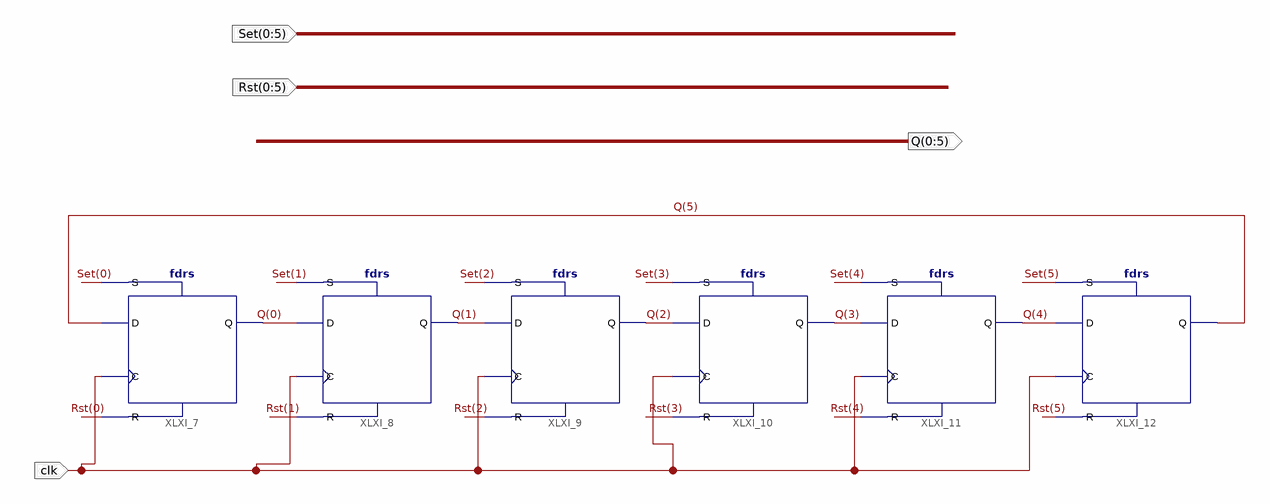
[diagram p0: schematic sheet 1]
// Xilinx ISE schematic ring_counter_6bit.sch (virtex4) as structural Verilog: 6 symbols, 4 ports
module ring_counter_6bit (
  input  [0:5] Set,
  input  [0:5] Rst,
  input  clk,
  output [0:5] Q
);

  fdrs XLXI_7 (.C(clk), .D(Q[5]), .R(Rst[0]), .S(Set[0]), .Q(Q[0]));
  fdrs XLXI_8 (.C(clk), .D(Q[0]), .R(Rst[1]), .S(Set[1]), .Q(Q[1]));
  fdrs XLXI_9 (.C(clk), .D(Q[1]), .R(Rst[2]), .S(Set[2]), .Q(Q[2]));
  fdrs XLXI_10 (.C(clk), .D(Q[2]), .R(Rst[3]), .S(Set[3]), .Q(Q[3]));
  fdrs XLXI_11 (.C(clk), .D(Q[3]), .R(Rst[4]), .S(Set[4]), .Q(Q[4]));
  fdrs XLXI_12 (.C(clk), .D(Q[4]), .R(Rst[5]), .S(Set[5]), .Q(Q[5]));
endmodule
